# Altium schematic sheet CURRENT_SENSE.SchDoc: DB/PB Current Sense
size A3
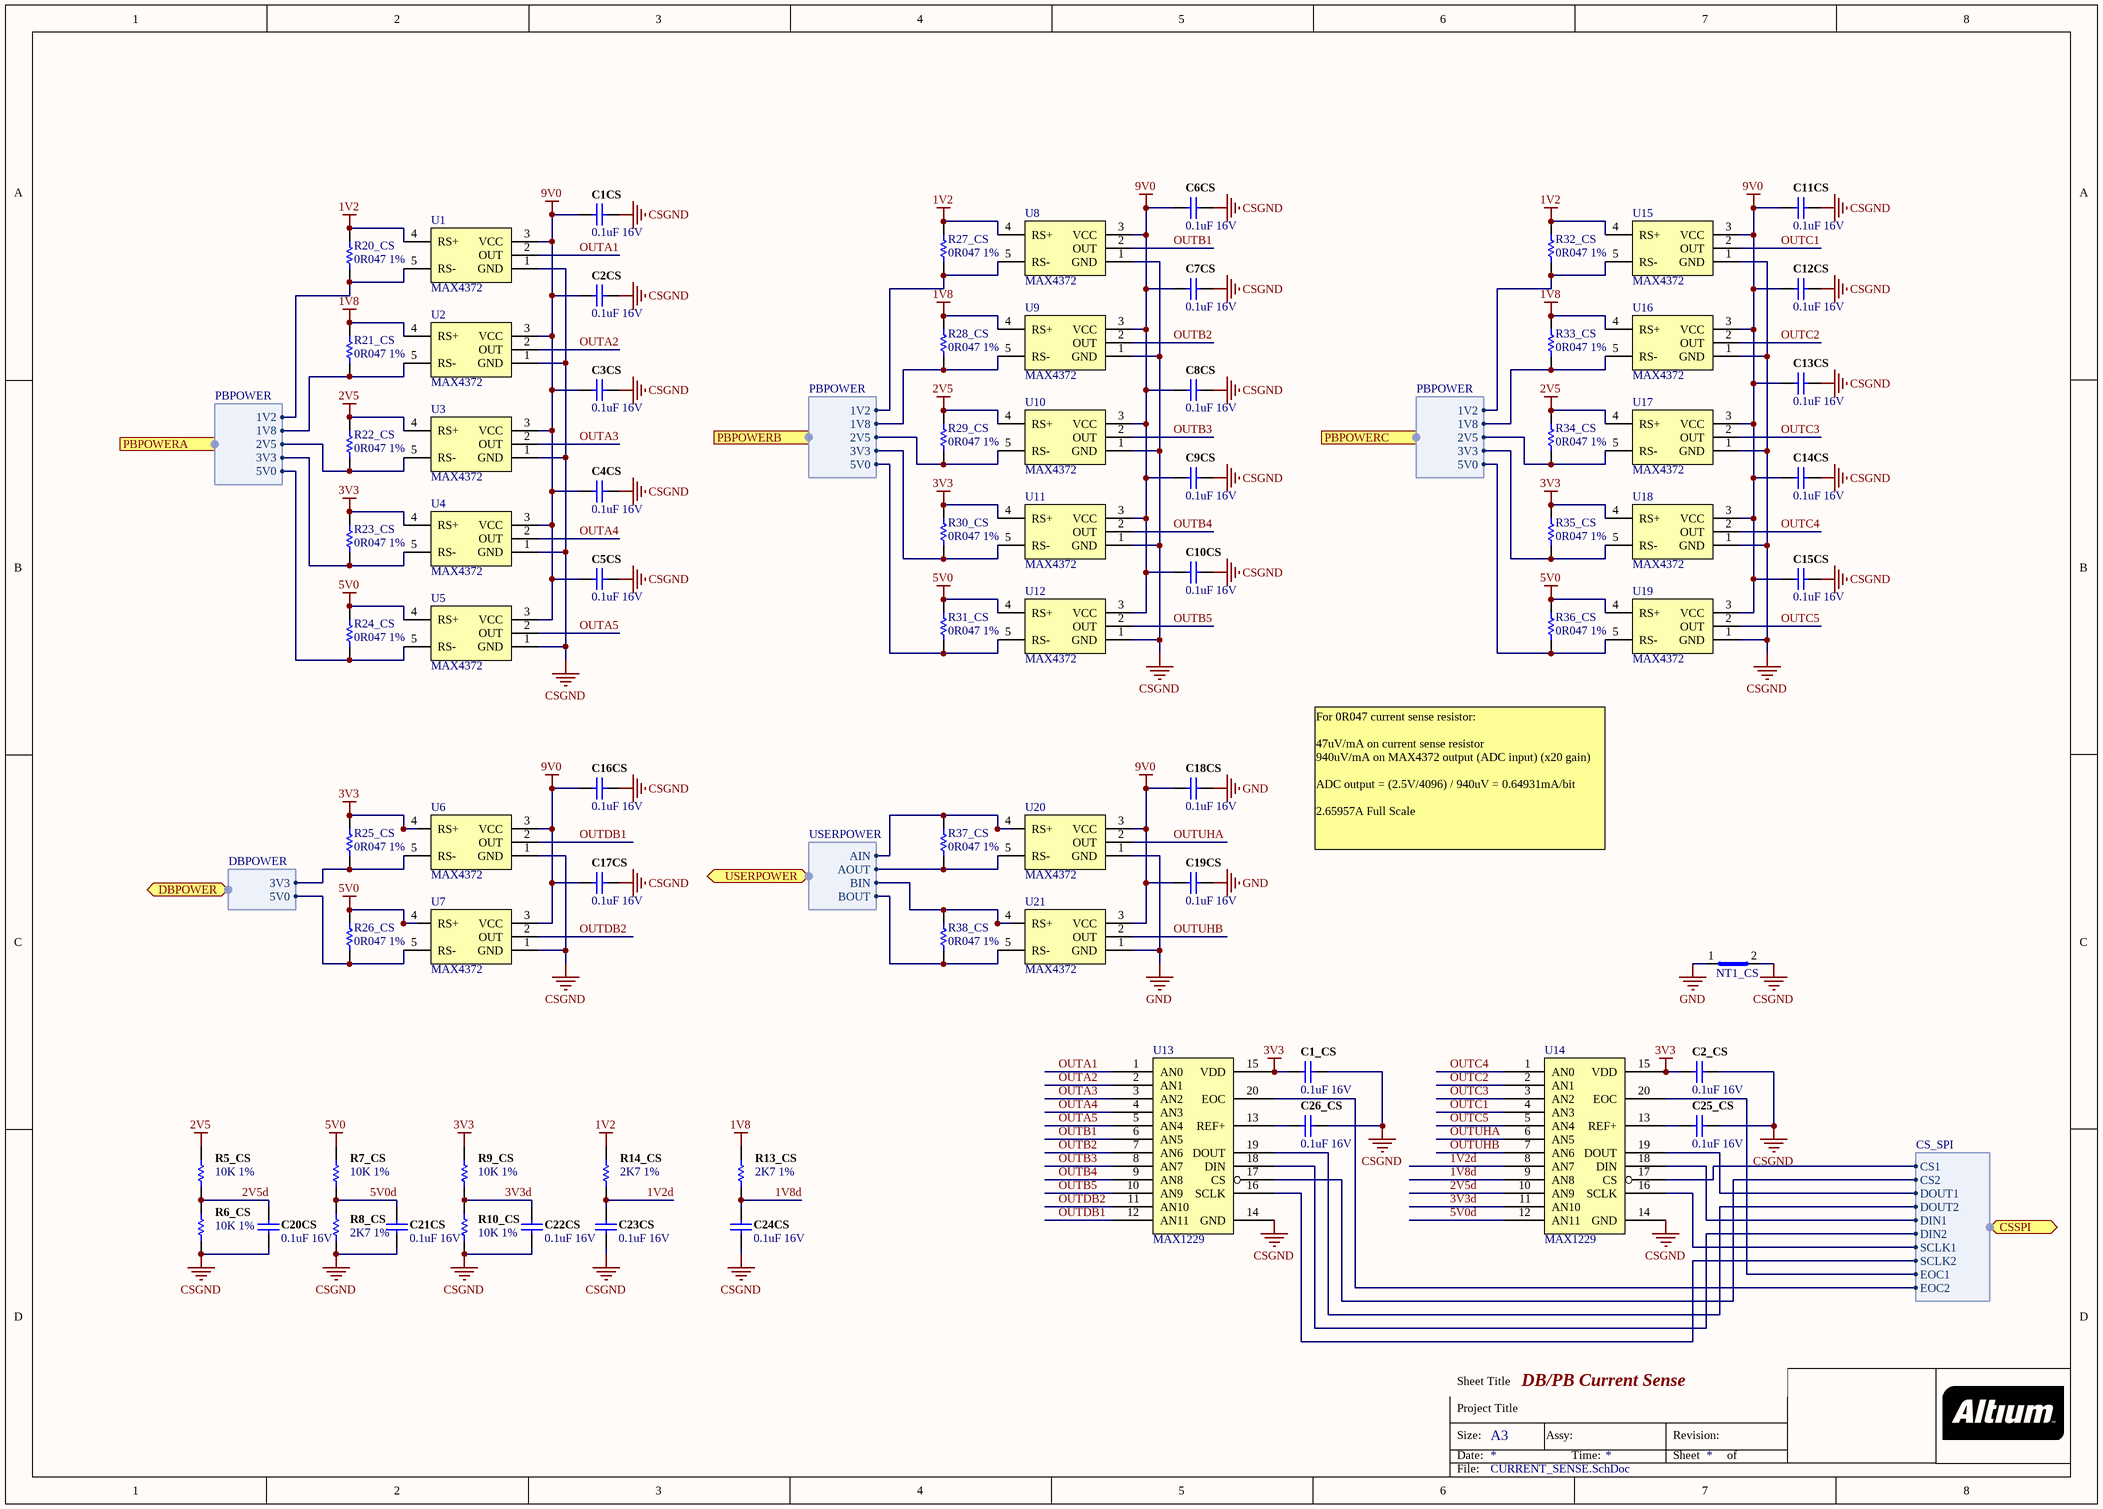
[diagram p0: CURRENT_SENSE.SchDoc]

## Parts
C1_CS  0.1uF 16V  [CAPC1005-STAR]
C1CS  0.1uF 16V  [CAPC1005-STAR]
C2_CS  0.1uF 16V  [CAPC1005-STAR]
C2CS  0.1uF 16V  [CAPC1005-STAR]
C3CS  0.1uF 16V  [CAPC1005-STAR]
C4CS  0.1uF 16V  [CAPC1005-STAR]
C5CS  0.1uF 16V  [CAPC1005-STAR]
C6CS  0.1uF 16V  [CAPC1005-STAR]
C7CS  0.1uF 16V  [CAPC1005-STAR]
C8CS  0.1uF 16V  [CAPC1005-STAR]
C9CS  0.1uF 16V  [CAPC1005-STAR]
C10CS  0.1uF 16V  [CAPC1005-STAR]
C11CS  0.1uF 16V  [CAPC1005-STAR]
C12CS  0.1uF 16V  [CAPC1005-STAR]
C13CS  0.1uF 16V  [CAPC1005-STAR]
C14CS  0.1uF 16V  [CAPC1005-STAR]
C15CS  0.1uF 16V  [CAPC1005-STAR]
C16CS  0.1uF 16V  [CAPC1005-STAR]
C17CS  0.1uF 16V  [CAPC1005-STAR]
C18CS  0.1uF 16V  [CAPC1005-STAR]
C19CS  0.1uF 16V  [CAPC1005-STAR]
C20CS  0.1uF 16V  [CAPC1005-STAR]
C21CS  0.1uF 16V  [CAPC1005-STAR]
C22CS  0.1uF 16V  [CAPC1005-STAR]
C23CS  0.1uF 16V  [CAPC1005-STAR]
C24CS  0.1uF 16V  [CAPC1005-STAR]
C25_CS  0.1uF 16V  [CAPC1005-STAR]
C26_CS  0.1uF 16V  [CAPC1005-STAR]
NT1_CS  Net Tie SMT2  [NETTIE-SMT2-8X8]  (value not drawn)  (net tie, no BOM)
R5_CS  10K 1%  [RESC1005-STAR]
R6_CS  10K 1%  [RESC1005-STAR]
R7_CS  10K 1%  [RESC1005-STAR]
R8_CS  2K7 1%  [RESC1005-STAR]
R9_CS  10K 1%  [RESC1005-STAR]
R10_CS  10K 1%  [RESC1005-STAR]
R13_CS  2K7 1%  [RESC1005-STAR]
R14_CS  2K7 1%  [RESC1005-STAR]
R20_CS  0R047 1%  [RESC3216]
R21_CS  0R047 1%  [RESC3216]
R22_CS  0R047 1%  [RESC3216]
R23_CS  0R047 1%  [RESC3216]
R24_CS  0R047 1%  [RESC3216]
R25_CS  0R047 1%  [RESC3216]
R26_CS  0R047 1%  [RESC3216]
R27_CS  0R047 1%  [RESC3216]
R28_CS  0R047 1%  [RESC3216]
R29_CS  0R047 1%  [RESC3216]
R30_CS  0R047 1%  [RESC3216]
R31_CS  0R047 1%  [RESC3216]
R32_CS  0R047 1%  [RESC3216]
R33_CS  0R047 1%  [RESC3216]
R34_CS  0R047 1%  [RESC3216]
R35_CS  0R047 1%  [RESC3216]
R36_CS  0R047 1%  [RESC3216]
R37_CS  0R047 1%  [RESC3216]
R38_CS  0R047 1%  [RESC3216]
U1  MAX4372  [SOT-23-5]
U2  MAX4372  [SOT-23-5]
U3  MAX4372  [SOT-23-5]
U4  MAX4372  [SOT-23-5]
U5  MAX4372  [SOT-23-5]
U6  MAX4372  [SOT-23-5]
U7  MAX4372  [SOT-23-5]
U8  MAX4372  [SOT-23-5]
U9  MAX4372  [SOT-23-5]
U10  MAX4372  [SOT-23-5]
U11  MAX4372  [SOT-23-5]
U12  MAX4372  [SOT-23-5]
U13  MAX1229  [QSOP65P600-20]
U14  MAX1229  [QSOP65P600-20]
U15  MAX4372  [SOT-23-5]
U16  MAX4372  [SOT-23-5]
U17  MAX4372  [SOT-23-5]
U18  MAX4372  [SOT-23-5]
U19  MAX4372  [SOT-23-5]
U20  MAX4372  [SOT-23-5]
U21  MAX4372  [SOT-23-5]

## Ports
CSSPI (harness CS_SPI), DBPOWER (harness DBPOWER), PBPOWERA (harness PBPOWER), PBPOWERB (harness PBPOWER), PBPOWERC (harness PBPOWER), USERPOWER (harness USERPOWER)

## Harnesses
PBPOWER: 1V2, 1V8, 2V5, 3V3, 5V0
DBPOWER: 3V3, 5V0
USERPOWER: AIN, BIN, AOUT, BOUT
CS_SPI: CS2, DOUT1, DOUT2, DIN1, CS1, DIN2, SCLK1, EOC1, SCLK2, EOC2

## Nets
1V2: R14_CS.2 R20_CS.1 R27_CS.1 R32_CS.1 U1.4(RS+) U8.4(RS+) U15.4(RS+)
1V8: R13_CS.2 R21_CS.1 R28_CS.1 R33_CS.1 U2.4(RS+) U9.4(RS+) U16.4(RS+)
2V5: R5_CS.2 R22_CS.1 R29_CS.1 R34_CS.1 U3.4(RS+) U10.4(RS+) U17.4(RS+)
3V3: C1_CS.1 C2_CS.1 R9_CS.2 R23_CS.1 R25_CS.1 R30_CS.1 R35_CS.1 U4.4(RS+) U6.4(RS+) U11.4(RS+) U13.15(VDD) U14.15(VDD) U18.4(RS+)
5V0: R7_CS.2 R24_CS.1 R26_CS.1 R31_CS.1 R36_CS.1 U5.4(RS+) U7.4(RS+) U12.4(RS+) U19.4(RS+)
9V0: C1CS.1 C2CS.1 C3CS.1 C4CS.1 C5CS.1 C6CS.1 C7CS.1 C8CS.1 C9CS.1 C10CS.1 C11CS.1 C12CS.1 C13CS.1 C14CS.1 C15CS.1 C16CS.1 C17CS.1 C18CS.1 C19CS.1 U1.3(VCC) U2.3(VCC) U3.3(VCC) U4.3(VCC) U5.3(VCC) U6.3(VCC) U7.3(VCC) U8.3(VCC) U9.3(VCC) U10.3(VCC) U11.3(VCC) U12.3(VCC) U15.3(VCC) U16.3(VCC) U17.3(VCC) U18.3(VCC) U19.3(VCC) U20.3(VCC) U21.3(VCC)
CSGND: C1_CS.2 C1CS.2 C2_CS.2 C2CS.2 C3CS.2 C4CS.2 C5CS.2 C6CS.2 C7CS.2 C8CS.2 C9CS.2 C10CS.2 C11CS.2 C12CS.2 C13CS.2 C14CS.2 C15CS.2 C16CS.2 C17CS.2 C20CS.1 C21CS.1 C22CS.1 C23CS.1 C24CS.1 C25_CS.2 C26_CS.2 NT1_CS.2(Net2) R6_CS.1 R8_CS.1 R10_CS.1 U1.1(GND) U2.1(GND) U3.1(GND) U4.1(GND) U5.1(GND) U6.1(GND) U7.1(GND) U8.1(GND) U9.1(GND) U10.1(GND) U11.1(GND) U12.1(GND) U13.14(GND) U14.14(GND) U15.1(GND) U16.1(GND) U17.1(GND) U18.1(GND) U19.1(GND)
GND: C18CS.2 C19CS.2 NT1_CS.1(Net1) U20.1(GND) U21.1(GND)
1V2d: C23CS.2 R14_CS.1 U14.8(AN7)
1V8d: C24CS.2 R13_CS.1 U14.9(AN8)
2V5d: C20CS.2 R5_CS.1 R6_CS.2 U14.10(AN9)
3V3d: C22CS.2 R9_CS.1 R10_CS.2 U14.11(AN10)
5V0d: C21CS.2 R7_CS.1 R8_CS.2 U14.12(AN11)
OUTA1: U1.2(OUT) U13.1(AN0)
OUTA2: U2.2(OUT) U13.2(AN1)
OUTA3: U3.2(OUT) U13.3(AN2)
OUTA4: U4.2(OUT) U13.4(AN3)
OUTA5: U5.2(OUT) U13.5(AN4)
OUTB1: U8.2(OUT) U13.6(AN5)
OUTB2: U9.2(OUT) U13.7(AN6)
OUTB3: U10.2(OUT) U13.8(AN7)
OUTB4: U11.2(OUT) U13.9(AN8)
OUTB5: U12.2(OUT) U13.10(AN9)
OUTC1: U14.4(AN3) U15.2(OUT)
OUTC2: U14.2(AN1) U16.2(OUT)
OUTC3: U14.3(AN2) U17.2(OUT)
OUTC4: U14.1(AN0) U18.2(OUT)
OUTC5: U14.5(AN4) U19.2(OUT)
OUTDB1: U6.2(OUT) U13.12(AN11)
OUTDB2: U7.2(OUT) U13.11(AN10)
OUTUHA: U14.6(AN5) U20.2(OUT)
OUTUHB: U14.7(AN6) U21.2(OUT)
NetC25_CS_1: C25_CS.1 U14.13(REF+)
NetC26_CS_1: C26_CS.1 U13.13(REF+)
NetR20_CS_2: R20_CS.2 U1.5(RS-) ; port PBPOWERA.1V2
NetR21_CS_2: R21_CS.2 U2.5(RS-) ; port PBPOWERA.1V8
NetR22_CS_2: R22_CS.2 U3.5(RS-) ; port PBPOWERA.2V5
NetR23_CS_2: R23_CS.2 U4.5(RS-) ; port PBPOWERA.3V3
NetR24_CS_2: R24_CS.2 U5.5(RS-) ; port PBPOWERA.5V0
NetR25_CS_2: R25_CS.2 U6.5(RS-) ; port DBPOWER.3V3
NetR26_CS_2: R26_CS.2 U7.5(RS-) ; port DBPOWER.5V0
NetR27_CS_2: R27_CS.2 U8.5(RS-) ; port PBPOWERB.1V2
NetR28_CS_2: R28_CS.2 U9.5(RS-) ; port PBPOWERB.1V8
NetR29_CS_2: R29_CS.2 U10.5(RS-) ; port PBPOWERB.2V5
NetR30_CS_2: R30_CS.2 U11.5(RS-) ; port PBPOWERB.3V3
NetR31_CS_2: R31_CS.2 U12.5(RS-) ; port PBPOWERB.5V0
NetR32_CS_2: R32_CS.2 U15.5(RS-) ; port PBPOWERC.1V2
NetR33_CS_2: R33_CS.2 U16.5(RS-) ; port PBPOWERC.1V8
NetR34_CS_2: R34_CS.2 U17.5(RS-) ; port PBPOWERC.2V5
NetR35_CS_2: R35_CS.2 U18.5(RS-) ; port PBPOWERC.3V3
NetR36_CS_2: R36_CS.2 U19.5(RS-) ; port PBPOWERC.5V0
NetR37_CS_1: R37_CS.1 U20.4(RS+) ; port USERPOWER.AIN
NetR37_CS_2: R37_CS.2 U20.5(RS-) ; port USERPOWER.AOUT
NetR38_CS_1: R38_CS.1 U21.4(RS+) ; port USERPOWER.BIN
NetR38_CS_2: R38_CS.2 U21.5(RS-) ; port USERPOWER.BOUT
NetU13_16: U13.16(SCLK) ; port CSSPI.SCLK2
NetU13_17: U13.17(CS) ; port CSSPI.CS2
NetU13_18: U13.18(DIN) ; port CSSPI.DIN2
NetU13_19: U13.19(DOUT) ; port CSSPI.DOUT2
NetU13_20: U13.20(EOC) ; port CSSPI.EOC2
NetU14_16: U14.16(SCLK) ; port CSSPI.SCLK1
NetU14_17: U14.17(CS) ; port CSSPI.CS1
NetU14_18: U14.18(DIN) ; port CSSPI.DIN1
NetU14_19: U14.19(DOUT) ; port CSSPI.DOUT1
NetU14_20: U14.20(EOC) ; port CSSPI.EOC1

## Notes on the sheet
- For 0R047 current sense resistor:
  47uV/mA on current sense resistor
  940uV/mA on MAX4372 output (ADC input) (x20 gain)
  ADC output = (2.5V/4096) / 940uV = 0.64931mA/bit
  2.65957A Full Scale
- Sheet Title
- Project Title
- Size:
- Date:
- A3
- Assy:
- Time:
- Revision:
- Sheet
- of
- File:

## Library data of the parts
C1_CS C1CS C2_CS C2CS C3CS C4CS C5CS C6CS C7CS C8CS C9CS C10CS C11CS C12CS C13CS C14CS C15CS C16CS C17CS C18CS C19CS C20CS C21CS C22CS C23CS C24CS C25_CS C26_CS = D-101-0080: Capacitor, Ceramic, 0.1uF 10% 16V 0402 (1005) X7R; Polarity: Non-Polarized; Category: Capacitor; Capacitance: 0.1 uF; Dielectric: X7R; Mounting Technology: Surface Mount; Rated Voltage: 16 V; Status: Production; Technology: Ceramic; Tolerance: 10 %
NT1_CS = D-002-0002: Net-Tie, Surface Mount, 2 x 0.4mm x 0.2mm SMT Pads - For 0.2mm Track; Status: Production; Category: Net-Tie
R5_CS R6_CS R7_CS R9_CS R10_CS = D-100-0130: Resistor, 10K 1% 0402 (1005); Power Rating: 63 mW; Category: Resistor; Mounting Technology: Surface Mount; Resistance: 10 K; Status: Production; Tolerance: 1 %
R8_CS R13_CS R14_CS = D-100-0105: Resistor, 2K7 1% 0402 (1005); Power Rating: 63 mW; Resistance: 2.7 K; Category: Resistor; Mounting Technology: Surface Mount; Status: Production; Tolerance: 1 %
R20_CS R21_CS R22_CS R23_CS R24_CS R25_CS R26_CS R27_CS R28_CS R29_CS R30_CS R31_CS R32_CS R33_CS R34_CS R35_CS R36_CS R37_CS R38_CS = D-100-0007: Resistor, 0R047, LRC02P, SMD, 1206, Thick Film, Current Sense, 1%; Power Rating: mW; Resistance: 47 mR; Mounting Technology: Surface Mount; Status: Production; Tolerance: 1 %; Category: Resistor
U1-U12 U15-U21 = D-204-0012: MAX4372 High Side Current Sense Amplifier; Max Input Voltage: mV; Max Output Current: mA; Max Output Voltage: mV; Min Input Voltage: mV; Min Output Voltage: mV; Mounting Technology: Surface Mount; Status: Production; Supply Voltage: mV; Category: IC-Power
U13 U14 = D-220-0003: MAX1229, 12bit ADC, 12 channel, 3.3V, SPI; Bit Width: 12 Bits; Max Sample Frequency: Hz; Digital Interface: SPI; Mounting Technology: Surface Mount; Status: Production; Supply Voltage: 3.3 V; Category: IC-ADC